# Altium project MC-IMX6Q-BOARD.PRJPCB
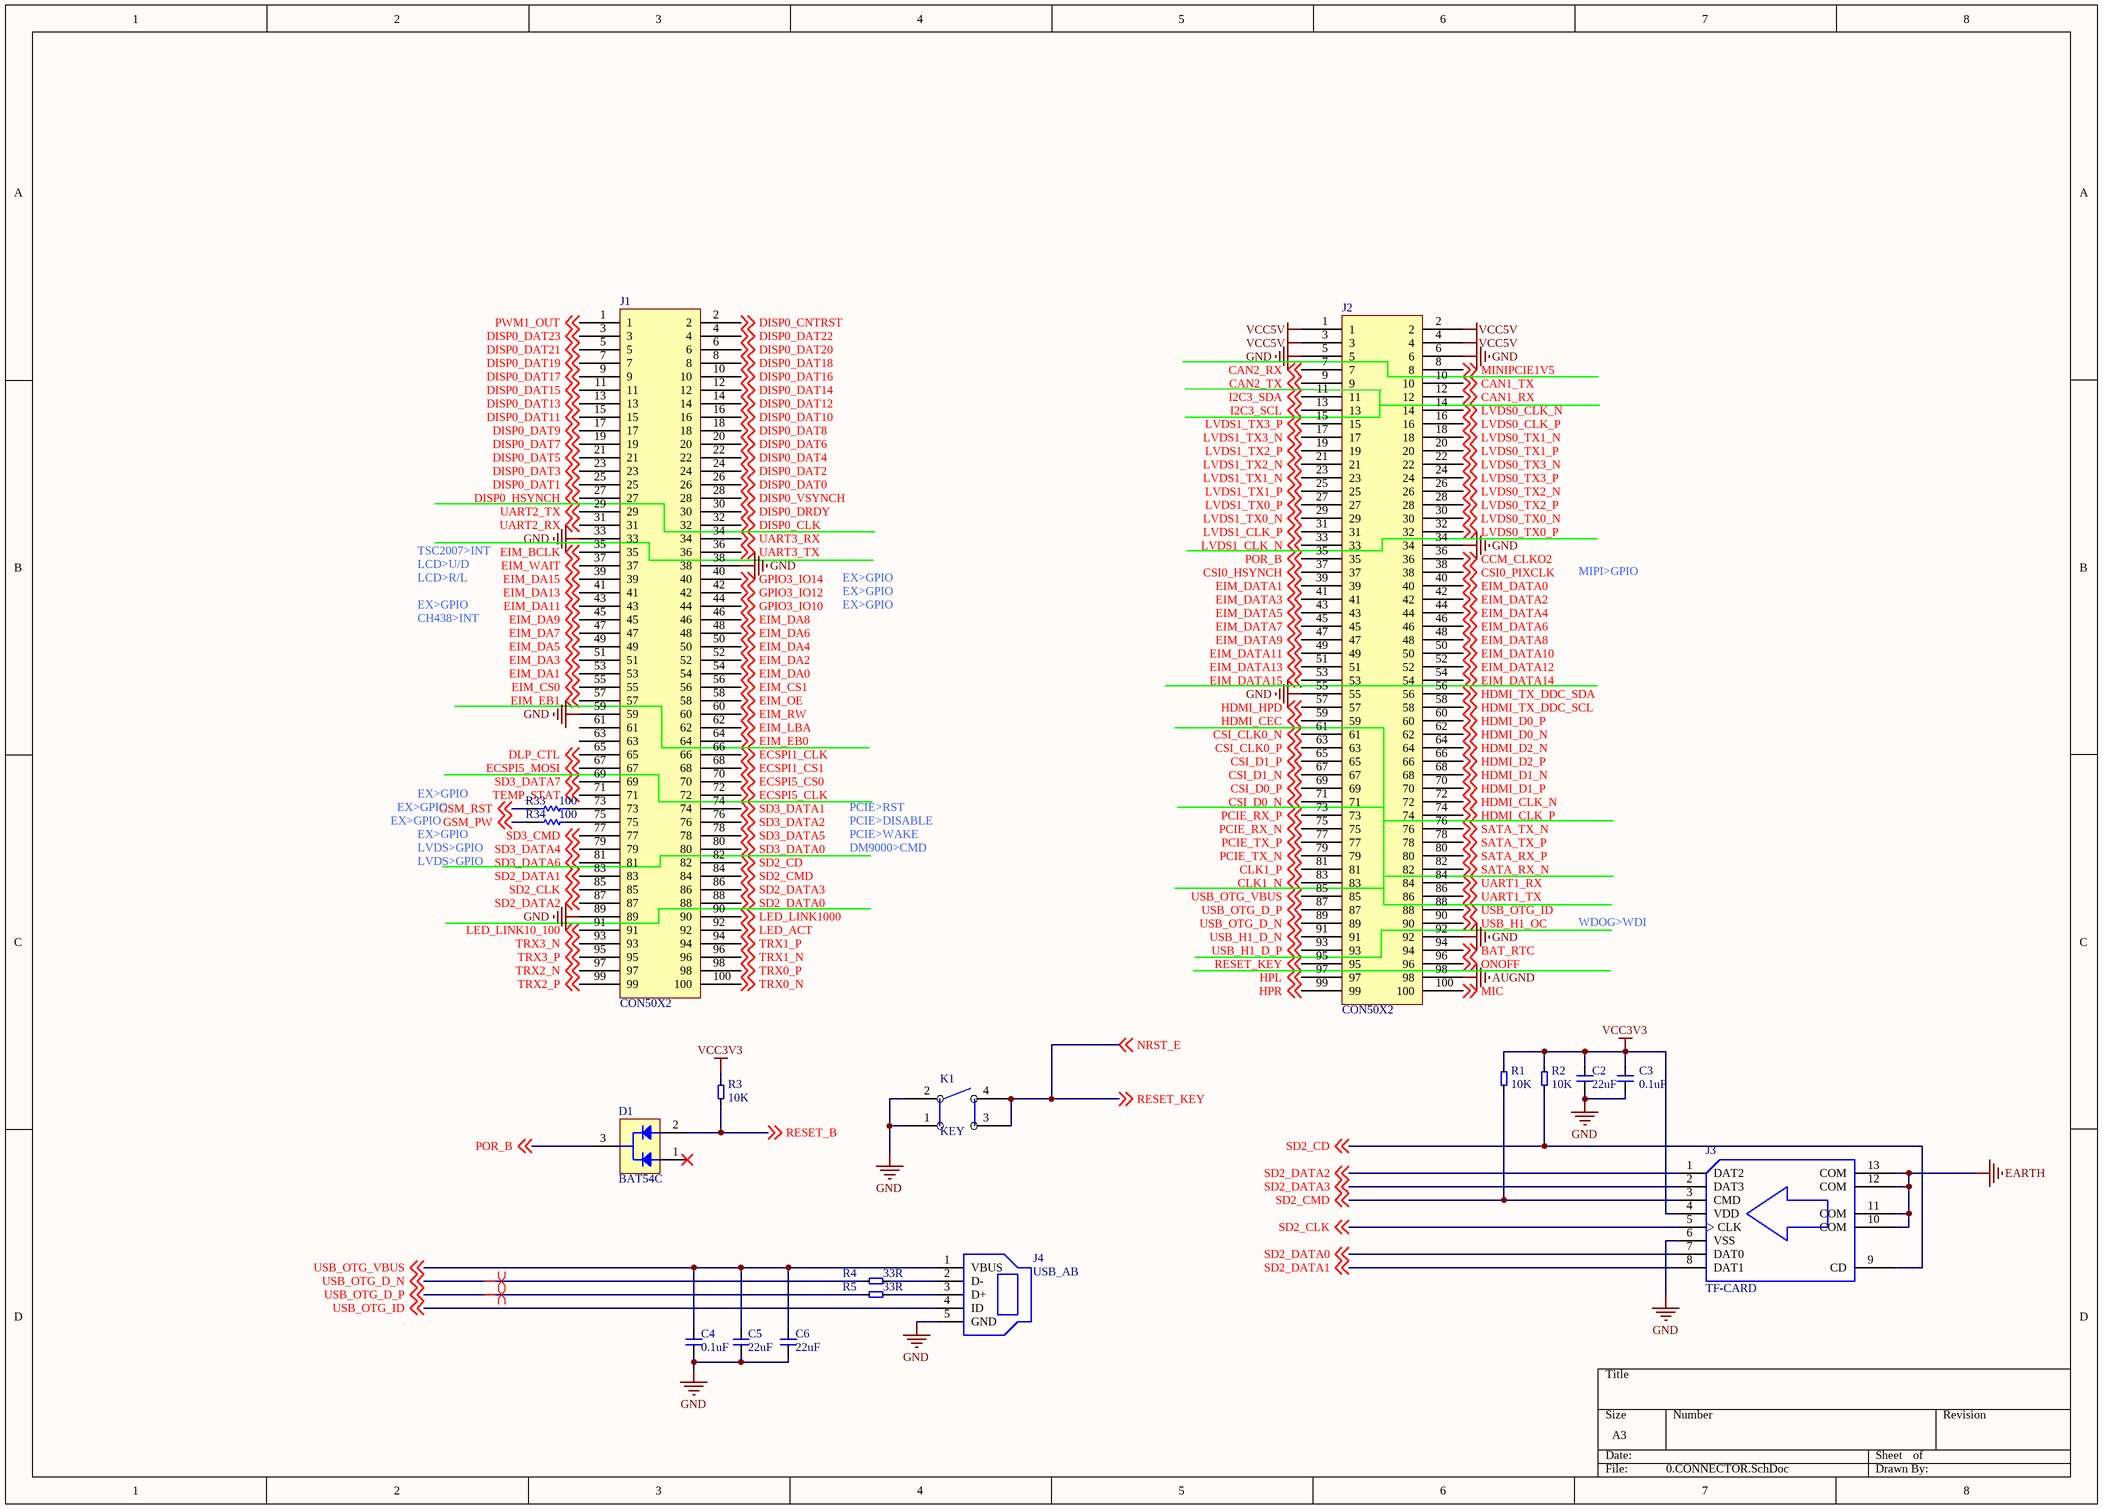
[diagram p0: 0.CONNECTOR.SchDoc]
4 sheets, 101 parts. Net scope: global (net labels, ports and power ports of the same name join across sheets).
Board file: IMX6.PcbDoc
Sheets:
  0.CONNECTOR.SchDoc
  1.POWER.SchDoc
  2.ETH.SchDoc
  9.RGB&TOUCH.SchDoc

## Sheet 0.CONNECTOR.SchDoc
size A3

### Parts
C2  22uF  [0603C]
C3  0.1uF  [0603C]
C4  0.1uF  [0603C]
C5  22uF  [0603C]
C6  22uF  [0603C]
D1  BAT54C  [SOT-23]
J1  CON50X2  [IDC50X2-1.27MM_SMT]
J2  CON50X2  [IDC50X2-1.27MM_SMT]
J3  TF-CARD  [TF-CARD]
J4  USB_AB  [MINI USB B]
K1  KEY  [SS-SPB-4.5]
R1  10K  [0603R]
R2  10K  [0603R]
R3  10K  [0603R]
R4  33R  [0603R]
R5  33R  [0603R]
R33  value 100  [0603]  (hidden comment: Res1)
R34  value 100  [0603]  (hidden comment: Res1)

### Nets
AUGND: C2.1 C3.1 C4.1 C5.1 C6.1 J1.33 J1.38 J1.59 J1.89 J2.5 J2.6 J2.34 J2.55 J2.92 J2.98 J3.6(VSS) J3.10(COM) J3.11(COM) J3.12(COM) J3.13(COM) J4.5(GND) J4.6(9) J4.7(9) J4.8(9) J4.9 K1.1 K1.2  [also labelled EARTH, GND]
VCC3V3: C2.2 C3.2 J3.4(VDD) R1.2 R2.2 R3.2  [project net +3.3V]
VCC5V: J2.1 J2.2 J2.3 J2.4
BAT_RTC: J2.94 ; off-sheet BAT_RTC
CAN1_RX: J2.12 ; off-sheet CAN1_RX
CAN1_TX: J2.10 ; off-sheet CAN1_TX
CAN2_RX: J2.7 ; off-sheet CAN2_RX
CAN2_TX: J2.9 ; off-sheet CAN2_TX
CCM_CLKO2: J2.36 ; off-sheet CCM_CLKO2
CLK1_N: J2.83 ; off-sheet CLK1_N
CLK1_P: J2.81 ; off-sheet CLK1_P
CSI0_HSYNCH: J2.37 ; off-sheet CSI0_HSYNCH
CSI0_PIXCLK: J2.38 ; off-sheet CSI0_PIXCLK
CSI_CLK0_N: J2.61 ; off-sheet CSI_CLK0_N
CSI_CLK0_P: J2.63 ; off-sheet CSI_CLK0_P
CSI_D0_N: J2.71 ; off-sheet CSI_D0_N
CSI_D0_P: J2.69 ; off-sheet CSI_D0_P
CSI_D1_N: J2.67 ; off-sheet CSI_D1_N
CSI_D1_P: J2.65 ; off-sheet CSI_D1_P
DISP0_CLK: J1.32 ; off-sheet DISP0_CLK
DISP0_CNTRST: J1.2 ; off-sheet DISP0_CNTRST
DISP0_DAT0: J1.26 ; off-sheet DISP0_DAT0
DISP0_DAT1: J1.25 ; off-sheet DISP0_DAT1
DISP0_DAT2: J1.24 ; off-sheet DISP0_DAT2
DISP0_DAT3: J1.23 ; off-sheet DISP0_DAT3
DISP0_DAT4: J1.22 ; off-sheet DISP0_DAT4
DISP0_DAT5: J1.21 ; off-sheet DISP0_DAT5
DISP0_DAT6: J1.20 ; off-sheet DISP0_DAT6
DISP0_DAT7: J1.19 ; off-sheet DISP0_DAT7
DISP0_DAT8: J1.18 ; off-sheet DISP0_DAT8
DISP0_DAT9: J1.17 ; off-sheet DISP0_DAT9
DISP0_DAT10: J1.16 ; off-sheet DISP0_DAT10
DISP0_DAT11: J1.15 ; off-sheet DISP0_DAT11
DISP0_DAT12: J1.14 ; off-sheet DISP0_DAT12
DISP0_DAT13: J1.13 ; off-sheet DISP0_DAT13
DISP0_DAT14: J1.12 ; off-sheet DISP0_DAT14
DISP0_DAT15: J1.11 ; off-sheet DISP0_DAT15
DISP0_DAT16: J1.10 ; off-sheet DISP0_DAT16
DISP0_DAT17: J1.9 ; off-sheet DISP0_DAT17
DISP0_DAT18: J1.8 ; off-sheet DISP0_DAT18
DISP0_DAT19: J1.7 ; off-sheet DISP0_DAT19
DISP0_DAT20: J1.6 ; off-sheet DISP0_DAT20
DISP0_DAT21: J1.5 ; off-sheet DISP0_DAT21
DISP0_DAT22: J1.4 ; off-sheet DISP0_DAT22
DISP0_DAT23: J1.3 ; off-sheet DISP0_DAT23
DISP0_DRDY: J1.30 ; off-sheet DISP0_DRDY
DISP0_HSYNCH: J1.27 ; off-sheet DISP0_HSYNCH
DISP0_VSYNCH: J1.28 ; off-sheet DISP0_VSYNCH
DLP_CTL: J1.65 ; off-sheet DLP_CTL
ECSPI1_CLK: J1.66 ; off-sheet ECSPI1_CLK
ECSPI1_CS1: J1.68 ; off-sheet ECSPI1_CS1
ECSPI5_CLK: J1.72 ; off-sheet ECSPI5_CLK
ECSPI5_CS0: J1.70 ; off-sheet ECSPI5_CS0
ECSPI5_MOSI: J1.67 ; off-sheet ECSPI5_MOSI
EIM_BCLK: J1.35 ; off-sheet EIM_BCLK
EIM_CS0: J1.55 ; off-sheet EIM_CS0
EIM_CS1: J1.56 ; off-sheet EIM_CS1
EIM_DA0: J1.54 ; off-sheet EIM_DA0
EIM_DA1: J1.53 ; off-sheet EIM_DA1
EIM_DA2: J1.52 ; off-sheet EIM_DA2
EIM_DA3: J1.51 ; off-sheet EIM_DA3
EIM_DA4: J1.50 ; off-sheet EIM_DA4
EIM_DA5: J1.49 ; off-sheet EIM_DA5
EIM_DA6: J1.48 ; off-sheet EIM_DA6
EIM_DA7: J1.47 ; off-sheet EIM_DA7
EIM_DA8: J1.46 ; off-sheet EIM_DA8
EIM_DA9: J1.45 ; off-sheet EIM_DA9
EIM_DA11: J1.43 ; off-sheet EIM_DA11
EIM_DA13: J1.41 ; off-sheet EIM_DA13
EIM_DA15: J1.39 ; off-sheet EIM_DA15
EIM_DATA0: J2.40 ; off-sheet EIM_DATA0
EIM_DATA1: J2.39 ; off-sheet EIM_DATA1
EIM_DATA2: J2.42 ; off-sheet EIM_DATA2
EIM_DATA3: J2.41 ; off-sheet EIM_DATA3
EIM_DATA4: J2.44 ; off-sheet EIM_DATA4
EIM_DATA5: J2.43 ; off-sheet EIM_DATA5
EIM_DATA6: J2.46 ; off-sheet EIM_DATA6
EIM_DATA7: J2.45 ; off-sheet EIM_DATA7
EIM_DATA8: J2.48 ; off-sheet EIM_DATA8
EIM_DATA9: J2.47 ; off-sheet EIM_DATA9
EIM_DATA10: J2.50 ; off-sheet EIM_DATA10
EIM_DATA11: J2.49 ; off-sheet EIM_DATA11
EIM_DATA12: J2.52 ; off-sheet EIM_DATA12
EIM_DATA13: J2.51 ; off-sheet EIM_DATA13
EIM_DATA14: J2.54 ; off-sheet EIM_DATA14
EIM_DATA15: J2.53 ; off-sheet EIM_DATA15
EIM_EB0: J1.64 ; off-sheet EIM_EB0
EIM_EB1: J1.57 ; off-sheet EIM_EB1
EIM_LBA: J1.62 ; off-sheet EIM_LBA
EIM_OE: J1.58 ; off-sheet EIM_OE
EIM_RW: J1.60 ; off-sheet EIM_RW
EIM_WAIT: J1.37 ; off-sheet EIM_WAIT
GPIO3_IO10: J1.44 ; off-sheet GPIO3_IO10
GPIO3_IO12: J1.42 ; off-sheet GPIO3_IO12
GPIO3_IO14: J1.40 ; off-sheet GPIO3_IO14
GSM_PW: R34.2 ; off-sheet GSM_PW
GSM_RST: R33.2 ; off-sheet GSM_RST
HDMI_CEC: J2.59 ; off-sheet HDMI_CEC
HDMI_CLK_N: J2.72 ; off-sheet HDMI_CLK_N
HDMI_CLK_P: J2.74 ; off-sheet HDMI_CLK_P
HDMI_D0_N: J2.62 ; off-sheet HDMI_D0_N
HDMI_D0_P: J2.60 ; off-sheet HDMI_D0_P
HDMI_D1_N: J2.68 ; off-sheet HDMI_D1_N
HDMI_D1_P: J2.70 ; off-sheet HDMI_D1_P
HDMI_D2_N: J2.64 ; off-sheet HDMI_D2_N
HDMI_D2_P: J2.66 ; off-sheet HDMI_D2_P
HDMI_HPD: J2.57 ; off-sheet HDMI_HPD
HDMI_TX_DDC_SCL: J2.58 ; off-sheet HDMI_TX_DDC_SCL
HDMI_TX_DDC_SDA: J2.56 ; off-sheet HDMI_TX_DDC_SDA
HPL: J2.97 ; off-sheet HPL
HPR: J2.99 ; off-sheet HPR
I2C3_SCL: J2.13 ; off-sheet I2C3_SCL
I2C3_SDA: J2.11 ; off-sheet I2C3_SDA
LED_ACT: J1.92 ; off-sheet LED_ACT
LED_LINK10_100: J1.91 ; off-sheet LED_LINK10_100
LED_LINK1000: J1.90 ; off-sheet LED_LINK1000
LVDS0_CLK_N: J2.14 ; off-sheet LVDS0_CLK_N
LVDS0_CLK_P: J2.16 ; off-sheet LVDS0_CLK_P
LVDS0_TX0_N: J2.30 ; off-sheet LVDS0_TX0_N
LVDS0_TX0_P: J2.32 ; off-sheet LVDS0_TX0_P
LVDS0_TX1_N: J2.18 ; off-sheet LVDS0_TX1_N
LVDS0_TX1_P: J2.20 ; off-sheet LVDS0_TX1_P
LVDS0_TX2_N: J2.26 ; off-sheet LVDS0_TX2_N
LVDS0_TX2_P: J2.28 ; off-sheet LVDS0_TX2_P
LVDS0_TX3_N: J2.22 ; off-sheet LVDS0_TX3_N
LVDS0_TX3_P: J2.24 ; off-sheet LVDS0_TX3_P
LVDS1_CLK_N: J2.33 ; off-sheet LVDS1_CLK_N
LVDS1_CLK_P: J2.31 ; off-sheet LVDS1_CLK_P
LVDS1_TX0_N: J2.29 ; off-sheet LVDS1_TX0_N
LVDS1_TX0_P: J2.27 ; off-sheet LVDS1_TX0_P
LVDS1_TX1_N: J2.23 ; off-sheet LVDS1_TX1_N
LVDS1_TX1_P: J2.25 ; off-sheet LVDS1_TX1_P
LVDS1_TX2_N: J2.21 ; off-sheet LVDS1_TX2_N
LVDS1_TX2_P: J2.19 ; off-sheet LVDS1_TX2_P
LVDS1_TX3_N: J2.17 ; off-sheet LVDS1_TX3_N
LVDS1_TX3_P: J2.15 ; off-sheet LVDS1_TX3_P
MIC: J2.100 ; off-sheet MIC
MINIPCIE1V5: J2.8 ; off-sheet MINIPCIE1V5
NRST_E: J2.95 K1.3 K1.4 ; off-sheet RESET_KEY, off-sheet NRST_E  [also labelled RESET_KEY]
ONOFF: J2.96 ; off-sheet ONOFF
PCIE_RX_N: J2.75 ; off-sheet PCIE_RX_N
PCIE_RX_P: J2.73 ; off-sheet PCIE_RX_P
PCIE_TX_N: J2.79 ; off-sheet PCIE_TX_N
PCIE_TX_P: J2.77 ; off-sheet PCIE_TX_P
POR_B: D1.3 J2.35 ; off-sheet POR_B
PWM1_OUT: J1.1 ; off-sheet PWM1_OUT
RESET_B: D1.2 R3.1 ; off-sheet RESET_B
SATA_RX_N: J2.82 ; off-sheet SATA_RX_N
SATA_RX_P: J2.80 ; off-sheet SATA_RX_P
SATA_TX_N: J2.76 ; off-sheet SATA_TX_N
SATA_TX_P: J2.78 ; off-sheet SATA_TX_P
SD2_CD: J1.82 J3.9(CD) R2.1 ; off-sheet SD2_CD
SD2_CLK: J1.85 J3.5(CLK) ; off-sheet SD2_CLK
SD2_CMD: J1.84 J3.3(CMD) R1.1 ; off-sheet SD2_CMD
SD2_DATA0: J1.88 J3.7(DAT0) ; off-sheet SD2_DATA0
SD2_DATA1: J1.83 J3.8(DAT1) ; off-sheet SD2_DATA1
SD2_DATA2: J1.87 J3.1(DAT2) ; off-sheet SD2_DATA2
SD2_DATA3: J1.86 J3.2(DAT3) ; off-sheet SD2_DATA3
SD3_CMD: J1.77 ; off-sheet SD3_CMD
SD3_DATA0: J1.80 ; off-sheet SD3_DATA0
SD3_DATA1: J1.74 ; off-sheet SD3_DATA1
SD3_DATA2: J1.76 ; off-sheet SD3_DATA2
SD3_DATA4: J1.79 ; off-sheet SD3_DATA4
SD3_DATA5: J1.78 ; off-sheet SD3_DATA5
SD3_DATA6: J1.81 ; off-sheet SD3_DATA6
SD3_DATA7: J1.69 ; off-sheet SD3_DATA7
TEMP_STAT: J1.71 ; off-sheet TEMP_STAT
TRX0_N: J1.100 ; off-sheet TRX0_N
TRX0_P: J1.98 ; off-sheet TRX0_P
TRX1_N: J1.96 ; off-sheet TRX1_N
TRX1_P: J1.94 ; off-sheet TRX1_P
TRX2_N: J1.97 ; off-sheet TRX2_N
TRX2_P: J1.99 ; off-sheet TRX2_P
TRX3_N: J1.93 ; off-sheet TRX3_N
TRX3_P: J1.95 ; off-sheet TRX3_P
UART1_RX: J2.84 ; off-sheet UART1_RX
UART1_TX: J2.86 ; off-sheet UART1_TX
UART2_RX: J1.31 ; off-sheet UART2_RX
UART2_TX: J1.29 ; off-sheet UART2_TX
UART3_RX: J1.34 ; off-sheet UART3_RX
UART3_TX: J1.36 ; off-sheet UART3_TX
USB_H1_D_N: J2.91 ; off-sheet USB_H1_D_N
USB_H1_D_P: J2.93 ; off-sheet USB_H1_D_P
USB_H1_OC: J2.90 ; off-sheet USB_H1_OC
USB_OTG_D_N: J2.89 R4.2 ; off-sheet USB_OTG_D_N
USB_OTG_D_P: J2.87 R5.2 ; off-sheet USB_OTG_D_P
USB_OTG_ID: J2.88 J4.4(ID) ; off-sheet USB_OTG_ID
USB_OTG_VBUS: C4.2 C5.2 C6.2 J2.85 J4.1(VBUS) ; off-sheet USB_OTG_VBUS
NetJ1_73: J1.73 R33.1
NetJ1_75: J1.75 R34.1
NetJ4_2: J4.2(D-) R4.1
NetJ4_3: J4.3(D+) R5.1

Not connected (* = marked no-connect by the designer): D1 1*; J1 61 63

### Layout directives
differential pair: USB_OTG_D_N, USB_OTG_D_P

### Notes on the sheet
- TSC2007>INT
- LCD>U/D
- LCD>R/L
- EX>GPIO
- MIPI>GPIO
- CH438>INT
- LVDS>GPIO
- DM9000>CMD
- PCIE>WAKE
- PCIE>DISABLE
- PCIE>RST
- WDOG>WDI

### Library data of the parts
C2-C6 = 电容
D1 = BAT54C: SCHOTTKY DIODE
J1 J2 = CON50X2: ASTRON B2B Connector
J4 = USB_AB: 小USB插痤
K1 = 按键
R1-R5 = 电阻
R33 R34 = Res1: Resistor; Published: 8-Jun-2000; LatestRevisionDate: 17-Jul-2002; LatestRevisionNote: Re-released for DXP Platform.; PackageReference: AXIAL-0.3; Publisher: Altium Limited

## Sheet 1.POWER.SchDoc
size A4
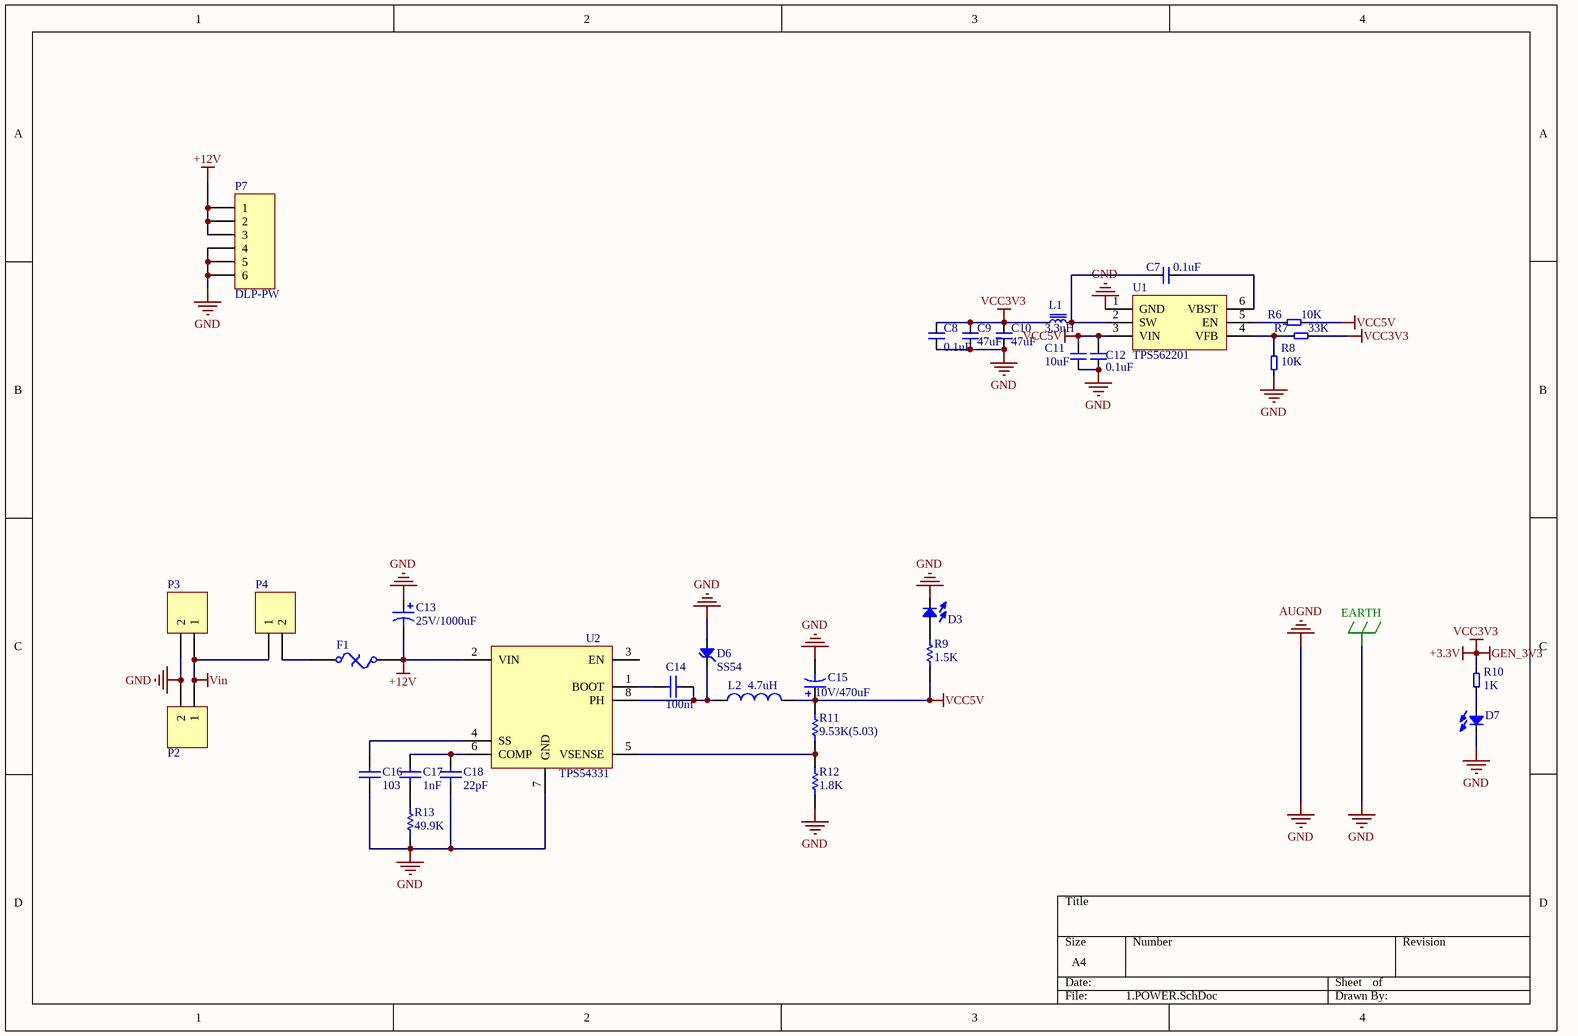
[diagram p1: 1.POWER.SchDoc]

### Parts
C7  0.1uF  [0603C]
C8  0.1uF  [0603C]
C9  47uF  [C1206]
C10  47uF  [C1206]
C11  10uF  [0603C]
C12  0.1uF  [0603C]
C13  value 25V/1000uF  [C10x5]  (hidden comment: Cap Pol3)
C14  value 100nf  [0603C]  (hidden comment: Cap)
C15  value 10V/470uF  [C8x4]  (hidden comment: Cap Pol3)
C16  value 103  [0603C]  (hidden comment: Cap)
C17  value 1nF  [0603C]  (hidden comment: Cap)
C18  value 22pF  [0603C]  (hidden comment: Cap)
D3  发光二极管  [0603D]  (value not drawn)
D6  SS54  [SMA]
D7  发光二极管  [0603D]  (value not drawn)
F1  Fuse Thermal  [1812F]  (value not drawn)
L1  3.3uH  [L4030]
L2  value 4.7uH  [L-6045]  (hidden comment: Inductor)
P2  Header 2  [XH2.54-2P]  (value not drawn)
P3  Header 2  [DC005]  (value not drawn)
P4  Header 2  [HDR1X2]  (value not drawn)
P7  DLP-PW  [SH1.0-6P]
R6  10K  [0603R]
R7  33K  [0603R]
R8  10K  [0603R]
R9  value 1.5K  [0603R]  (hidden comment: Res1)
R10  1K  [0603R]
R11  value 9.53K(5.03)  [0603R]  (hidden comment: Res Semi)
R12  value 1.8K  [0603R]  (hidden comment: Res Semi)
R13  value 49.9K  [0603R]  (hidden comment: Res Semi)
U1  TPS562201  [SOT23-6-DC]
U2  TPS54331  [SOP8-POW]

### Nets
+3.3V: C8.1 C9.1 C10.1 L1.1 R7.1 R10.2  [also labelled GEN_3V3, VCC3V3]
+12V: C13.2 F1.2 P7.1 P7.2 P7.3 U2.2(VIN)
AUGND: C8.2 C9.2 C10.2 C11.2 C12.2 C13.1 C15.2 C16.2 C18.1 D3.K D6.A D7.K P2.2 P3.2 P7.4 P7.5 P7.6 R8.1 R12.1 R13.1 U1.1(GND) U2.7(GND) U2.9(PAD)  [also labelled EARTH, GND]
VCC5V: C11.1 C12.1 C15.1 L2.2 R6.1 R9.1 R11.2 U1.3(VIN)
Vin: P2.1 P3.1 P4.1
NetC7_1: C7.1 L1.2 U1.2(SW)
NetC7_2: C7.2 U1.6(VBST)
NetC14_1: C14.1 D6.K L2.1 U2.8(PH)
NetC14_2: C14.2 U2.1(BOOT)
NetC16_1: C16.1 U2.4(SS)
NetC17_1: C17.1 R13.2
NetC17_2: C17.2 C18.2 U2.6(COMP)
NetD3_A: D3.A R9.2
NetD7_A: D7.A R10.1
NetF1_1: F1.1 P4.2
NetR6_2: R6.2 U1.5(EN)
NetR7_2: R7.2 R8.2 U1.4(VFB)
NetR11_1: R11.1 R12.2 U2.5(VSENSE)

Not connected (* = marked no-connect by the designer): U2 3(EN)

### Library data of the parts
C7-C12 = 电容
C13 C15 = Cap Pol3: Polarized Capacitor (Surface Mount); Published: 8-Jun-2000; LatestRevisionDate: 17-Jul-2002; LatestRevisionNote: Re-released for DXP Platform.; PackageReference: C0805; Publisher: Altium Limited
C14 C16-C18 = Cap: Capacitor; Published: 8-Jun-2000; LatestRevisionDate: 17-Jul-2002; LatestRevisionNote: Re-released for DXP Platform.; PackageReference: RAD-0.3; Publisher: Altium Limited
  C16-C18: PackageDescription: Radial Cap, Thru-Hole; 2 Leads; 0.3 in Pin Spacing
D6 = SS24: DIODES: *
F1 = Fuse Thermal: Thermal Fuse; Published: 24-Mar-1999; LatestRevisionDate: 17-Jul-2002; LatestRevisionNote: Re-released for DXP Platform.; PackageReference: PIN-W2/E2.8; Publisher: Altium Limited
L1 = 功率电感
L2 = Inductor: Code_IEC: 1005; Published: 8-Jun-2000; LatestRevisionDate: 17-Jul-2002; LatestRevisionNote: Re-released for DXP Platform.; PackageReference: 0402-A; Publisher: Altium Limited; Code_JEITA: 0402
P2-P4 = Header 2: Header, 2-Pin; LatestRevisionDate: 17-Jul-2002; LatestRevisionNote: Re-released for DXP Platform.; Publisher: Altium Limited
P7 = Header 6: Header, 6-Pin; LatestRevisionDate: 17-Jul-2002; LatestRevisionNote: Re-released for DXP Platform.; Publisher: Altium Limited
R6-R8 R10 = 电阻
R9 = Res1: Resistor; Published: 8-Jun-2000; LatestRevisionDate: 17-Jul-2002; LatestRevisionNote: Re-released for DXP Platform.; PackageReference: AXIAL-0.3; Publisher: Altium Limited
R11-R13 = Res Semi: Semiconductor Resistor; Published: 8-Jun-2000; LatestRevisionDate: 17-Jul-2002; LatestRevisionNote: Re-released for DXP Platform.; PackageReference: AXIAL-0.5; Publisher: Altium Limited; PackageDescription: Axial Device, Thru-Hole; 2 Leads; 0.5 in Pin Spacing

## Sheet 2.ETH.SchDoc
size A3
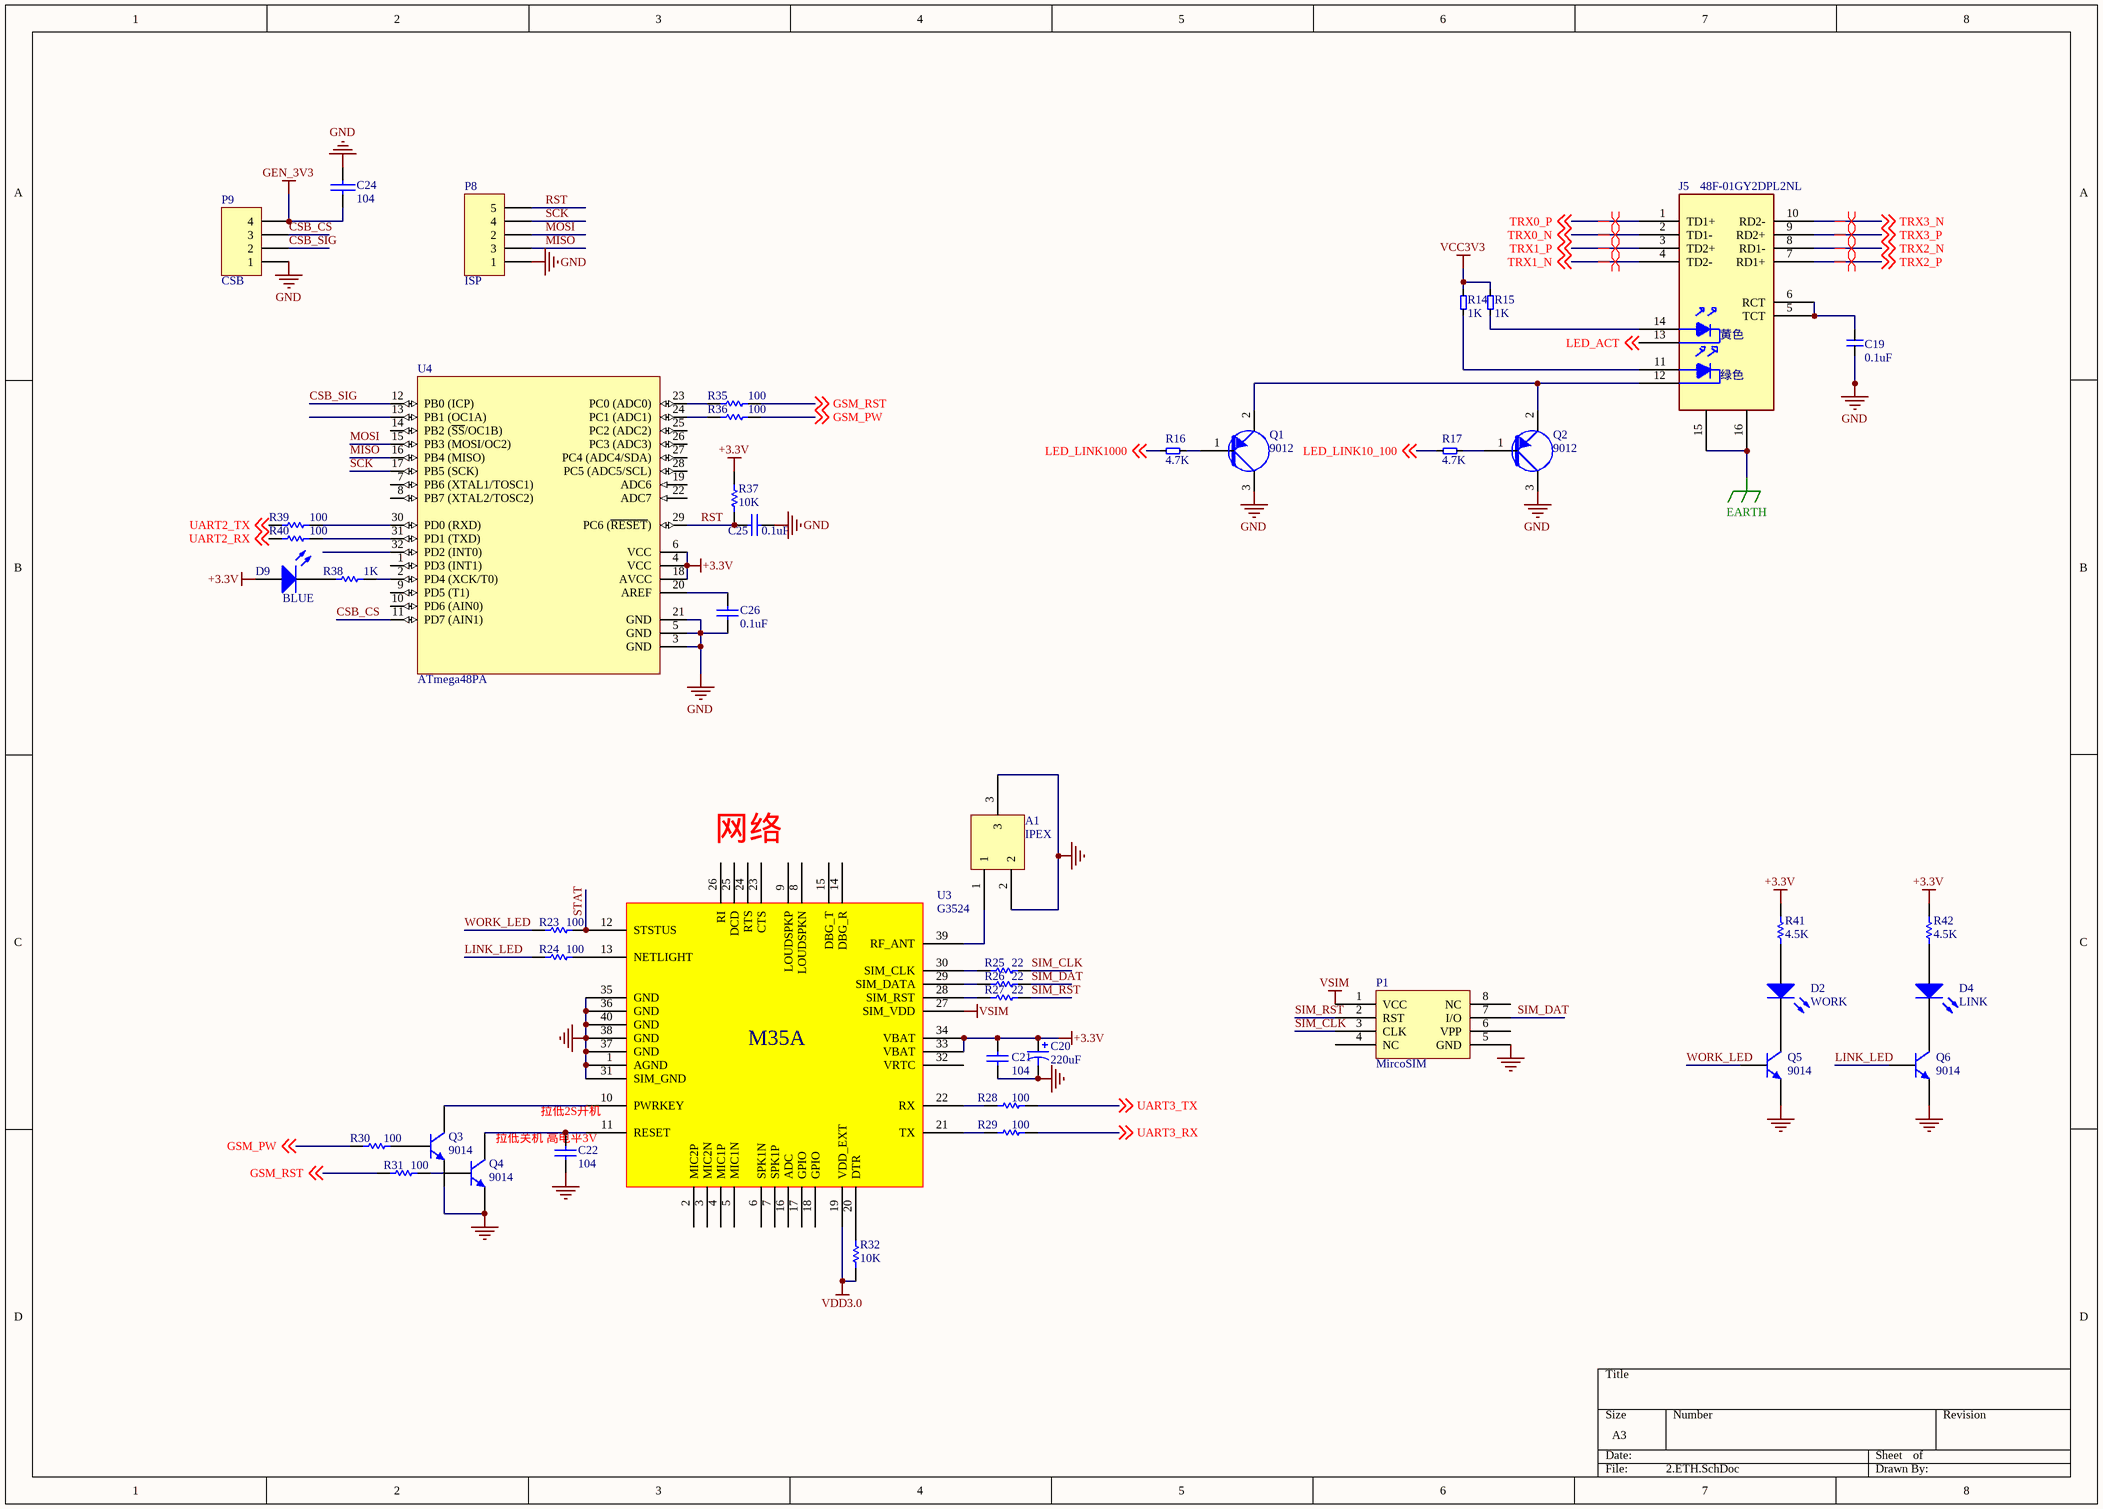
[diagram p2: 2.ETH.SchDoc]

### Parts
A1  IPEX  [IPEX]
C19  0.1uF  [0603C]
C20  value 220uF  [C7343]  (hidden comment: Cap Pol3)
C21  value 104  [0603]  (hidden comment: Cap)
C22  value 104  [0603]  (hidden comment: Cap)
C24  104  [0603]
C25  value 0.1uF  [0603]  (hidden comment: Cap)
C26  value 0.1uF  [0603]  (hidden comment: Cap)
D2  WORK  [0603-LED]
D4  LINK  [0603-LED]
D9  BLUE  [0603-LED]
J5  48F-01GY2DPL2NL  [RJ45C-48F-01GY2DPL2NL]
P1  MircoSIM  [Micro SIM]
P8  ISP  [HDR1X5]
P9  CSB  [HDR1X4]
Q1  9012  [SOT-23-PMOS]
Q2  9012  [SOT-23-PMOS]
Q3  value 9014  [SOT-23-NPN]  (hidden comment: NPN)
Q4  value 9014  [SOT-23-NPN]  (hidden comment: NPN)
Q5  value 9014  [SOT-23-NPN]  (hidden comment: NPN)
Q6  value 9014  [SOT-23-NPN]  (hidden comment: NPN)
R14  1K  [0603R]
R15  1K  [0603R]
R16  4.7K  [0603R]
R17  4.7K  [0603R]
R23  value 100  [0603]  (hidden comment: Res1)
R24  value 100  [0603]  (hidden comment: Res1)
R25  value 22  [0603]  (hidden comment: Res1)
R26  value 22  [0603]  (hidden comment: Res1)
R27  value 22  [0603]  (hidden comment: Res1)
R28  value 100  [0603]  (hidden comment: Res1)
R29  value 100  [0603]  (hidden comment: Res1)
R30  value 100  [0603]  (hidden comment: Res1)
R31  value 100  [0603]  (hidden comment: Res1)
R32  value 10K  [0603]  (hidden comment: Res1)
R35  value 100  [0603]  (hidden comment: Res1)
R36  value 100  [0603]  (hidden comment: Res1)
R37  value 10K  [0603]  (hidden comment: Res1)
R38  1K  [0603]
R39  value 100  [0603]  (hidden comment: Res1)
R40  value 100  [0603]  (hidden comment: Res1)
R41  value 4.5K  [0603]  (hidden comment: Res1)
R42  value 4.5K  [0603]  (hidden comment: Res1)
U3  G3524  [G3524]
U4  ATmega48PA  [32A_M]

### Nets
+3.3V: C20.1 C21.2 C24.2 D9.1(A) P9.4 R14.2 R15.2 R37.2 R41.1 R42.1 U3.33(VBAT) U3.34(VBAT) U4.4(VCC) U4.6(VCC) U4.18(AVCC)  [also labelled GEN_3V3, VCC3V3]
EARTH: A1.2 A1.3 C19.2 C20.2 C21.1 C22.2 C24.1 C25.2 C26.2 J5.15 J5.16 P1.5(GND) P8.1 P9.1 Q1.3 Q2.3 Q3.1(E) Q4.1(E) Q5.1(E) Q6.1(E) U3.1(AGND) U3.31(SIM_GND) U3.35(GND) U3.36(GND) U3.37(GND) U3.38(GND) U3.40(GND) U4.3(GND) U4.5(GND) U4.21(GND)  [also labelled GND]  [project net AUGND]
VDD3.0: R32.2 U3.19(VDD_EXT)
VSIM: P1.1(VCC) U3.27(SIM_VDD)
CSB_CS: P9.3 U4.11(PD7_(AIN1))
CSB_SIG: P9.2 U4.12(PB0_(ICP))
GSM_PW: R30.2 R36.1 ; off-sheet GSM_PW
GSM_RST: R31.2 R35.1 ; off-sheet GSM_RST
LED_ACT: J5.13 ; off-sheet LED_ACT
LED_LINK10_100: R17.2 ; off-sheet LED_LINK10_100
LED_LINK1000: R16.2 ; off-sheet LED_LINK1000
LINK_LED: Q6.2(B) R24.2
MISO: P8.3 U4.16(PB4_(MISO))
MOSI: P8.2 U4.15(PB3_(MOSI/OC2))
RST: C25.1 P8.5 R37.1 U4.29(PC6_(~{RESET}))
SCK: P8.4 U4.17(PB5_(SCK))
SIM_CLK: P1.3(CLK) R25.1
SIM_DAT: P1.7(I/O) R26.1
SIM_RST: P1.2(RST) R27.1
STAT: R23.1 U3.12(STSTUS)
TRX0_N: J5.2(TD1-) ; off-sheet TRX0_N
TRX0_P: J5.1(TD1+) ; off-sheet TRX0_P
TRX1_N: J5.4(TD2-) ; off-sheet TRX1_N
TRX1_P: J5.3(TD2+) ; off-sheet TRX1_P
TRX2_N: J5.8(RD1-) ; off-sheet TRX2_N
TRX2_P: J5.7(RD1+) ; off-sheet TRX2_P
TRX3_N: J5.10(RD2-) ; off-sheet TRX3_N
TRX3_P: J5.9(RD2+) ; off-sheet TRX3_P
UART2_RX: R40.2 ; off-sheet UART2_RX
UART2_TX: R39.2 ; off-sheet UART2_TX
UART3_RX: R29.2 ; off-sheet UART3_RX
UART3_TX: R28.2 ; off-sheet UART3_TX
WORK_LED: Q5.2(B) R23.2
NetA1_1: A1.1 U3.39(RF_ANT)
NetC19_1: C19.1 J5.5(TCT) J5.6(RCT)
NetC22_1: C22.1 Q4.3(C) U3.11(RESET)
NetC26_1: C26.1 U4.20(AREF)
NetD2_1: D2.1(A) R41.2
NetD2_2: D2.2(K) Q5.3(C)
NetD4_1: D4.1(A) R42.2
NetD4_2: D4.2(K) Q6.3(C)
NetD9_2: D9.2(K) R38.2
NetJ5_11: J5.11 R14.1
NetJ5_12: J5.12 Q1.2 Q2.2
NetJ5_14: J5.14 R15.1
NetQ1_1: Q1.1 R16.1
NetQ2_1: Q2.1 R17.1
NetQ3_2: Q3.2(B) R30.1
NetQ3_3: Q3.3(C) U3.10(PWRKEY)
NetQ4_2: Q4.2(B) R31.1
NetR24_1: R24.1 U3.13(NETLIGHT)
NetR25_2: R25.2 U3.30(SIM_CLK)
NetR26_2: R26.2 U3.29(SIM_DATA)
NetR27_2: R27.2 U3.28(SIM_RST)
NetR28_1: R28.1 U3.22(RX)
NetR29_1: R29.1 U3.21(TX)
NetR32_1: R32.1 U3.20(DTR)
NetR35_2: R35.2 U4.23(PC0_(ADC0))
NetR36_2: R36.2 U4.24(PC1_(ADC1))
NetR38_1: R38.1 U4.2(PD4_(XCK/T0))
NetR39_1: R39.1 U4.30(PD0_(RXD))
NetR40_1: R40.1 U4.31(PD1_(TXD))

Not connected (* = marked no-connect by the designer): P1 4(NC) 6(VPP) 8(NC); U3 2(MIC2P) 3(MIC2N) 4(MIC1P) 5(MIC1N) 6(SPK1N) 7(SPK1P) 8(LOUDSPKN) 9(LOUDSPKP) 14(DBG_R) 15(DBG_T) 16(ADC) 17(GPIO) 18(GPIO) 23(CTS) 24(RTS) 25(DCD) 26(RI) 32(VRTC); U4 1(PD3_(INT1)) 7(PB6_(XTAL1/TOSC1)) 8(PB7_(XTAL2/TOSC2)) 9(PD5_(T1)) 10(PD6_(AIN0)) 13(PB1_(OC1A)) 14(PB2_(~{SS}/OC1B)) 19(ADC6) 22(ADC7) 25(PC2_(ADC2)) 26(PC3_(ADC3)) 27(PC4_(ADC4/SDA)) 28(PC5_(ADC5/SCL)) 32(PD2_(INT0))

### Layout directives
differential pair: TRX0_N, TRX0_P, TRX1_N, TRX1_P, TRX2_N, TRX2_P, TRX3_N, TRX3_P

### Notes on the sheet
- 网络
- (near C22) 拉低2S开机
- 拉低关机 高电平3V
- (in symbol 48F-01GY2DPL2NL) 黄色; 绿色
- (in symbol G3524) M35A

### Library data of the parts
C19 = 电容
C20 = Cap Pol3: Polarized Capacitor (Surface Mount); Published: 8-Jun-2000; LatestRevisionDate: 17-Jul-2002; LatestRevisionNote: Re-released for DXP Platform.; PackageReference: C0805; Publisher: Altium Limited
C21 C22 C25 C26 = Cap: Capacitor; Published: 8-Jun-2000; LatestRevisionDate: 17-Jul-2002; LatestRevisionNote: Re-released for DXP Platform.; PackageReference: RAD-0.3; Publisher: Altium Limited
C24 = CAP
D2 D4 = LED2: Typical RED, GREEN, YELLOW, AMBER GaAs LED; Value: GRN; Published: 8-Jun-2000; LatestRevisionDate: 17-Jul-2002; LatestRevisionNote: Re-released for DXP Platform.; PackageDocument: Feb-2002; PackageReference: 3.2X1.6X1.1; Publisher: Altium Limited
D9 = LED2: Typical RED, GREEN, YELLOW, AMBER GaAs LED
P8 = Header 5: Header, 5-Pin; LatestRevisionDate: 17-Jul-2002; LatestRevisionNote: Re-released for DXP Platform.; Publisher: Altium Limited
P9 = Header 4: Header, 4-Pin; LatestRevisionDate: 17-Jul-2002; LatestRevisionNote: Re-released for DXP Platform.; Publisher: Altium Limited
Q3-Q6 = 2N5551: NPN General Purpose Amplifier; Published: 8-Jun-2000; LatestRevisionDate: 17-Jan-2003; LatestRevisionNote: PCB Footprint 'BCY-W3/D4.7' replaced; DatasheetDocument: 1997; PackageDocument: Sep-1998; PackageReference: TO-92A; Publisher: Altium Limited; ComponentLink1Description: Manufacturer Link; ComponentLink1URL: http://www.fairchildsemi.com/; ComponentLink2Description: Datasheet; ComponentLink2URL: http://www.fairchildsemi.com/ds/2N%2F2N5551.pdf
R14-R17 = 电阻
R23-R32 R35-R42 = Res1: Resistor
  R23-R32 R35-R37 R39-R42: Published: 8-Jun-2000; LatestRevisionDate: 17-Jul-2002; LatestRevisionNote: Re-released for DXP Platform.; PackageReference: AXIAL-0.3; Publisher: Altium Limited
U4 = ATmega8-16AC: 8-Bit AVR Microcontroller with 8K Bytes of In-System Programmable Flash Memory; Published: 17-Sep-2003; LatestRevisionDate: 13-Apr-2006; LatestRevisionNote: IPC-7351 Footprint Added.; DatasheetVersion: 2486H-AVR-09/02; PackageVersion: revB, Oct-2001; PackageReference: 32A; Publisher: Altium Limited; PackageDescription: 32-Pin Thin Quad Flat Pack 0.8 mm Pitch; Code_JEDEC: MS-026-ABA; ComponentLink1Description: Manufacturer Link; ComponentLink1URL: http://www.atmel.com; ComponentLink2Description: Datasheet; ComponentLink2URL: http://www.atmel.com/dyn/resources/prod_documents/doc2486.pdf

## Sheet 9.RGB&TOUCH.SchDoc
size A4
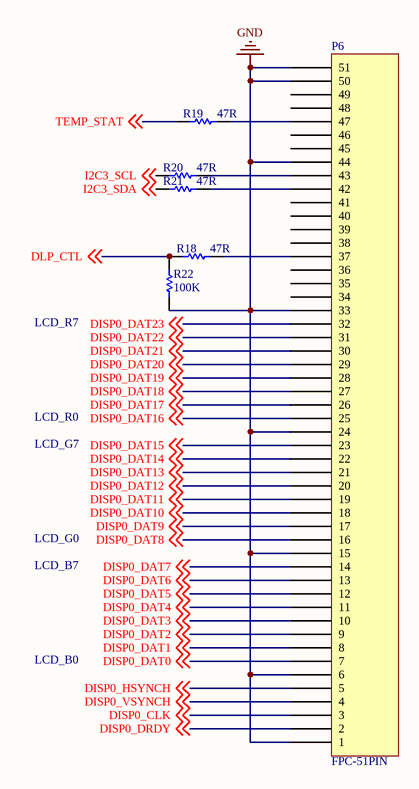
[diagram p3: 9.RGB&TOUCH.SchDoc]

### Parts
P6  FPC-51PIN  [FH26-51S-0.3SHW]
R18  47R  [0603]
R19  47R  [0603]
R20  47R  [0603]
R21  47R  [0603]
R22  100K  [0603]

### Nets
GND: P6.1 P6.6 P6.15 P6.24 P6.33 P6.44 P6.50 P6.51 R22.1  [project net AUGND]
DISP0_CLK: P6.3 ; off-sheet DISP0_CLK
DISP0_DAT0: P6.7 ; off-sheet DISP0_DAT0
DISP0_DAT1: P6.8 ; off-sheet DISP0_DAT1
DISP0_DAT2: P6.9 ; off-sheet DISP0_DAT2
DISP0_DAT3: P6.10 ; off-sheet DISP0_DAT3
DISP0_DAT4: P6.11 ; off-sheet DISP0_DAT4
DISP0_DAT5: P6.12 ; off-sheet DISP0_DAT5
DISP0_DAT6: P6.13 ; off-sheet DISP0_DAT6
DISP0_DAT7: P6.14 ; off-sheet DISP0_DAT7
DISP0_DAT8: P6.16 ; off-sheet DISP0_DAT8
DISP0_DAT9: P6.17 ; off-sheet DISP0_DAT9
DISP0_DAT10: P6.18 ; off-sheet DISP0_DAT10
DISP0_DAT11: P6.19 ; off-sheet DISP0_DAT11
DISP0_DAT12: P6.20 ; off-sheet DISP0_DAT12
DISP0_DAT13: P6.21 ; off-sheet DISP0_DAT13
DISP0_DAT14: P6.22 ; off-sheet DISP0_DAT14
DISP0_DAT15: P6.23 ; off-sheet DISP0_DAT15
DISP0_DAT16: P6.25 ; off-sheet DISP0_DAT16
DISP0_DAT17: P6.26 ; off-sheet DISP0_DAT17
DISP0_DAT18: P6.27 ; off-sheet DISP0_DAT18
DISP0_DAT19: P6.28 ; off-sheet DISP0_DAT19
DISP0_DAT20: P6.29 ; off-sheet DISP0_DAT20
DISP0_DAT21: P6.30 ; off-sheet DISP0_DAT21
DISP0_DAT22: P6.31 ; off-sheet DISP0_DAT22
DISP0_DAT23: P6.32 ; off-sheet DISP0_DAT23
DISP0_DRDY: P6.2 ; off-sheet DISP0_DRDY
DISP0_HSYNCH: P6.5 ; off-sheet DISP0_HSYNCH
DISP0_VSYNCH: P6.4 ; off-sheet DISP0_VSYNCH
DLP_CTL: R18.1 R22.2 ; off-sheet DLP_CTL
I2C3_SCL: R20.1 ; off-sheet I2C3_SCL
I2C3_SDA: R21.1 ; off-sheet I2C3_SDA
TEMP_STAT: R19.1 ; off-sheet TEMP_STAT
NetP6_37: P6.37 R18.2
NetP6_42: P6.42 R21.2
NetP6_43: P6.43 R20.2
NetP6_47: P6.47 R19.2

Not connected (* = marked no-connect by the designer): P6 34 35 36 38 39 40 41 45 46 48 49

### Notes on the sheet
- LCD_R7
- LCD_G7
- LCD_R0
- LCD_B7
- LCD_G0
- LCD_B0

### Library data of the parts
R18-R22 = Res1: Resistor

## Nets that join several sheets
+3.3V: 0.CONNECTOR (6 pins), 1.POWER (6 pins), 2.ETH (15 pins)
AUGND: 0.CONNECTOR (27 pins), 1.POWER (23 pins), 2.ETH (30 pins), 9.RGB&TOUCH (9 pins)
VCC5V: 0.CONNECTOR (J2.1 J2.2 J2.3 J2.4), 1.POWER (8 pins)
DISP0_CLK: 0.CONNECTOR (J1.32), 9.RGB&TOUCH (P6.3)
DISP0_DAT0: 0.CONNECTOR (J1.26), 9.RGB&TOUCH (P6.7)
DISP0_DAT1: 0.CONNECTOR (J1.25), 9.RGB&TOUCH (P6.8)
DISP0_DAT2: 0.CONNECTOR (J1.24), 9.RGB&TOUCH (P6.9)
DISP0_DAT3: 0.CONNECTOR (J1.23), 9.RGB&TOUCH (P6.10)
DISP0_DAT4: 0.CONNECTOR (J1.22), 9.RGB&TOUCH (P6.11)
DISP0_DAT5: 0.CONNECTOR (J1.21), 9.RGB&TOUCH (P6.12)
DISP0_DAT6: 0.CONNECTOR (J1.20), 9.RGB&TOUCH (P6.13)
DISP0_DAT7: 0.CONNECTOR (J1.19), 9.RGB&TOUCH (P6.14)
DISP0_DAT8: 0.CONNECTOR (J1.18), 9.RGB&TOUCH (P6.16)
DISP0_DAT9: 0.CONNECTOR (J1.17), 9.RGB&TOUCH (P6.17)
DISP0_DAT10: 0.CONNECTOR (J1.16), 9.RGB&TOUCH (P6.18)
DISP0_DAT11: 0.CONNECTOR (J1.15), 9.RGB&TOUCH (P6.19)
DISP0_DAT12: 0.CONNECTOR (J1.14), 9.RGB&TOUCH (P6.20)
DISP0_DAT13: 0.CONNECTOR (J1.13), 9.RGB&TOUCH (P6.21)
DISP0_DAT14: 0.CONNECTOR (J1.12), 9.RGB&TOUCH (P6.22)
DISP0_DAT15: 0.CONNECTOR (J1.11), 9.RGB&TOUCH (P6.23)
DISP0_DAT16: 0.CONNECTOR (J1.10), 9.RGB&TOUCH (P6.25)
DISP0_DAT17: 0.CONNECTOR (J1.9), 9.RGB&TOUCH (P6.26)
DISP0_DAT18: 0.CONNECTOR (J1.8), 9.RGB&TOUCH (P6.27)
DISP0_DAT19: 0.CONNECTOR (J1.7), 9.RGB&TOUCH (P6.28)
DISP0_DAT20: 0.CONNECTOR (J1.6), 9.RGB&TOUCH (P6.29)
DISP0_DAT21: 0.CONNECTOR (J1.5), 9.RGB&TOUCH (P6.30)
DISP0_DAT22: 0.CONNECTOR (J1.4), 9.RGB&TOUCH (P6.31)
DISP0_DAT23: 0.CONNECTOR (J1.3), 9.RGB&TOUCH (P6.32)
DISP0_DRDY: 0.CONNECTOR (J1.30), 9.RGB&TOUCH (P6.2)
DISP0_HSYNCH: 0.CONNECTOR (J1.27), 9.RGB&TOUCH (P6.5)
DISP0_VSYNCH: 0.CONNECTOR (J1.28), 9.RGB&TOUCH (P6.4)
DLP_CTL: 0.CONNECTOR (J1.65), 9.RGB&TOUCH (R18.1 R22.2)
GSM_PW: 0.CONNECTOR (R34.2), 2.ETH (R30.2 R36.1)
GSM_RST: 0.CONNECTOR (R33.2), 2.ETH (R31.2 R35.1)
I2C3_SCL: 0.CONNECTOR (J2.13), 9.RGB&TOUCH (R20.1)
I2C3_SDA: 0.CONNECTOR (J2.11), 9.RGB&TOUCH (R21.1)
LED_ACT: 0.CONNECTOR (J1.92), 2.ETH (J5.13)
LED_LINK10_100: 0.CONNECTOR (J1.91), 2.ETH (R17.2)
LED_LINK1000: 0.CONNECTOR (J1.90), 2.ETH (R16.2)
TEMP_STAT: 0.CONNECTOR (J1.71), 9.RGB&TOUCH (R19.1)
TRX0_N: 0.CONNECTOR (J1.100), 2.ETH (J5.2)
TRX0_P: 0.CONNECTOR (J1.98), 2.ETH (J5.1)
TRX1_N: 0.CONNECTOR (J1.96), 2.ETH (J5.4)
TRX1_P: 0.CONNECTOR (J1.94), 2.ETH (J5.3)
TRX2_N: 0.CONNECTOR (J1.97), 2.ETH (J5.8)
TRX2_P: 0.CONNECTOR (J1.99), 2.ETH (J5.7)
TRX3_N: 0.CONNECTOR (J1.93), 2.ETH (J5.10)
TRX3_P: 0.CONNECTOR (J1.95), 2.ETH (J5.9)
UART2_RX: 0.CONNECTOR (J1.31), 2.ETH (R40.2)
UART2_TX: 0.CONNECTOR (J1.29), 2.ETH (R39.2)
UART3_RX: 0.CONNECTOR (J1.34), 2.ETH (R29.2)
UART3_TX: 0.CONNECTOR (J1.36), 2.ETH (R28.2)